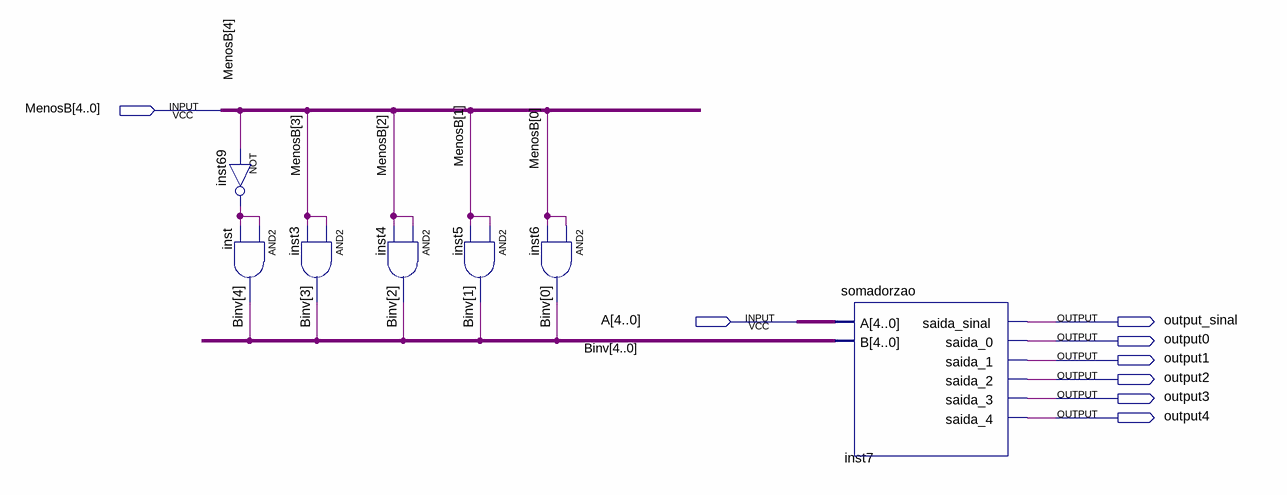
[diagram p0: schematic sheet]
// Quartus schematic Subtratorzao.bdf as structural Verilog: 7 symbols, 8 pins
module Subtratorzao (
  input  [4:0] MenosB,
  input  [4:0] A,
  output output_sinal,
  output output0,
  output output1,
  output output2,
  output output3,
  output output4
);

  wire inst69_out;
  wire [4:0] Binv;

  not inst69 (inst69_out, MenosB[4]);
  and inst (Binv[4], inst69_out, inst69_out);
  and inst3 (Binv[3], MenosB[3], MenosB[3]);
  and inst4 (Binv[2], MenosB[2], MenosB[2]);
  and inst5 (Binv[1], MenosB[1], MenosB[1]);
  and inst6 (Binv[0], MenosB[0], MenosB[0]);
  somadorzao inst7 (
    .A(A), .B(Binv), .saida_sinal(output_sinal), .saida_0(output0), .saida_1(output1), .saida_2(output2),
    .saida_3(output3), .saida_4(output4));
endmodule
